# EasyEDA Pro project AcGunV2 - 副本.eprj

# Schematic Schematic1
Create Date: 2023-02-09; Page Name: P1; Project Name: AcGunV2 - 副本; Schematic Name: Schematic1; Update Date: 2023-03-13
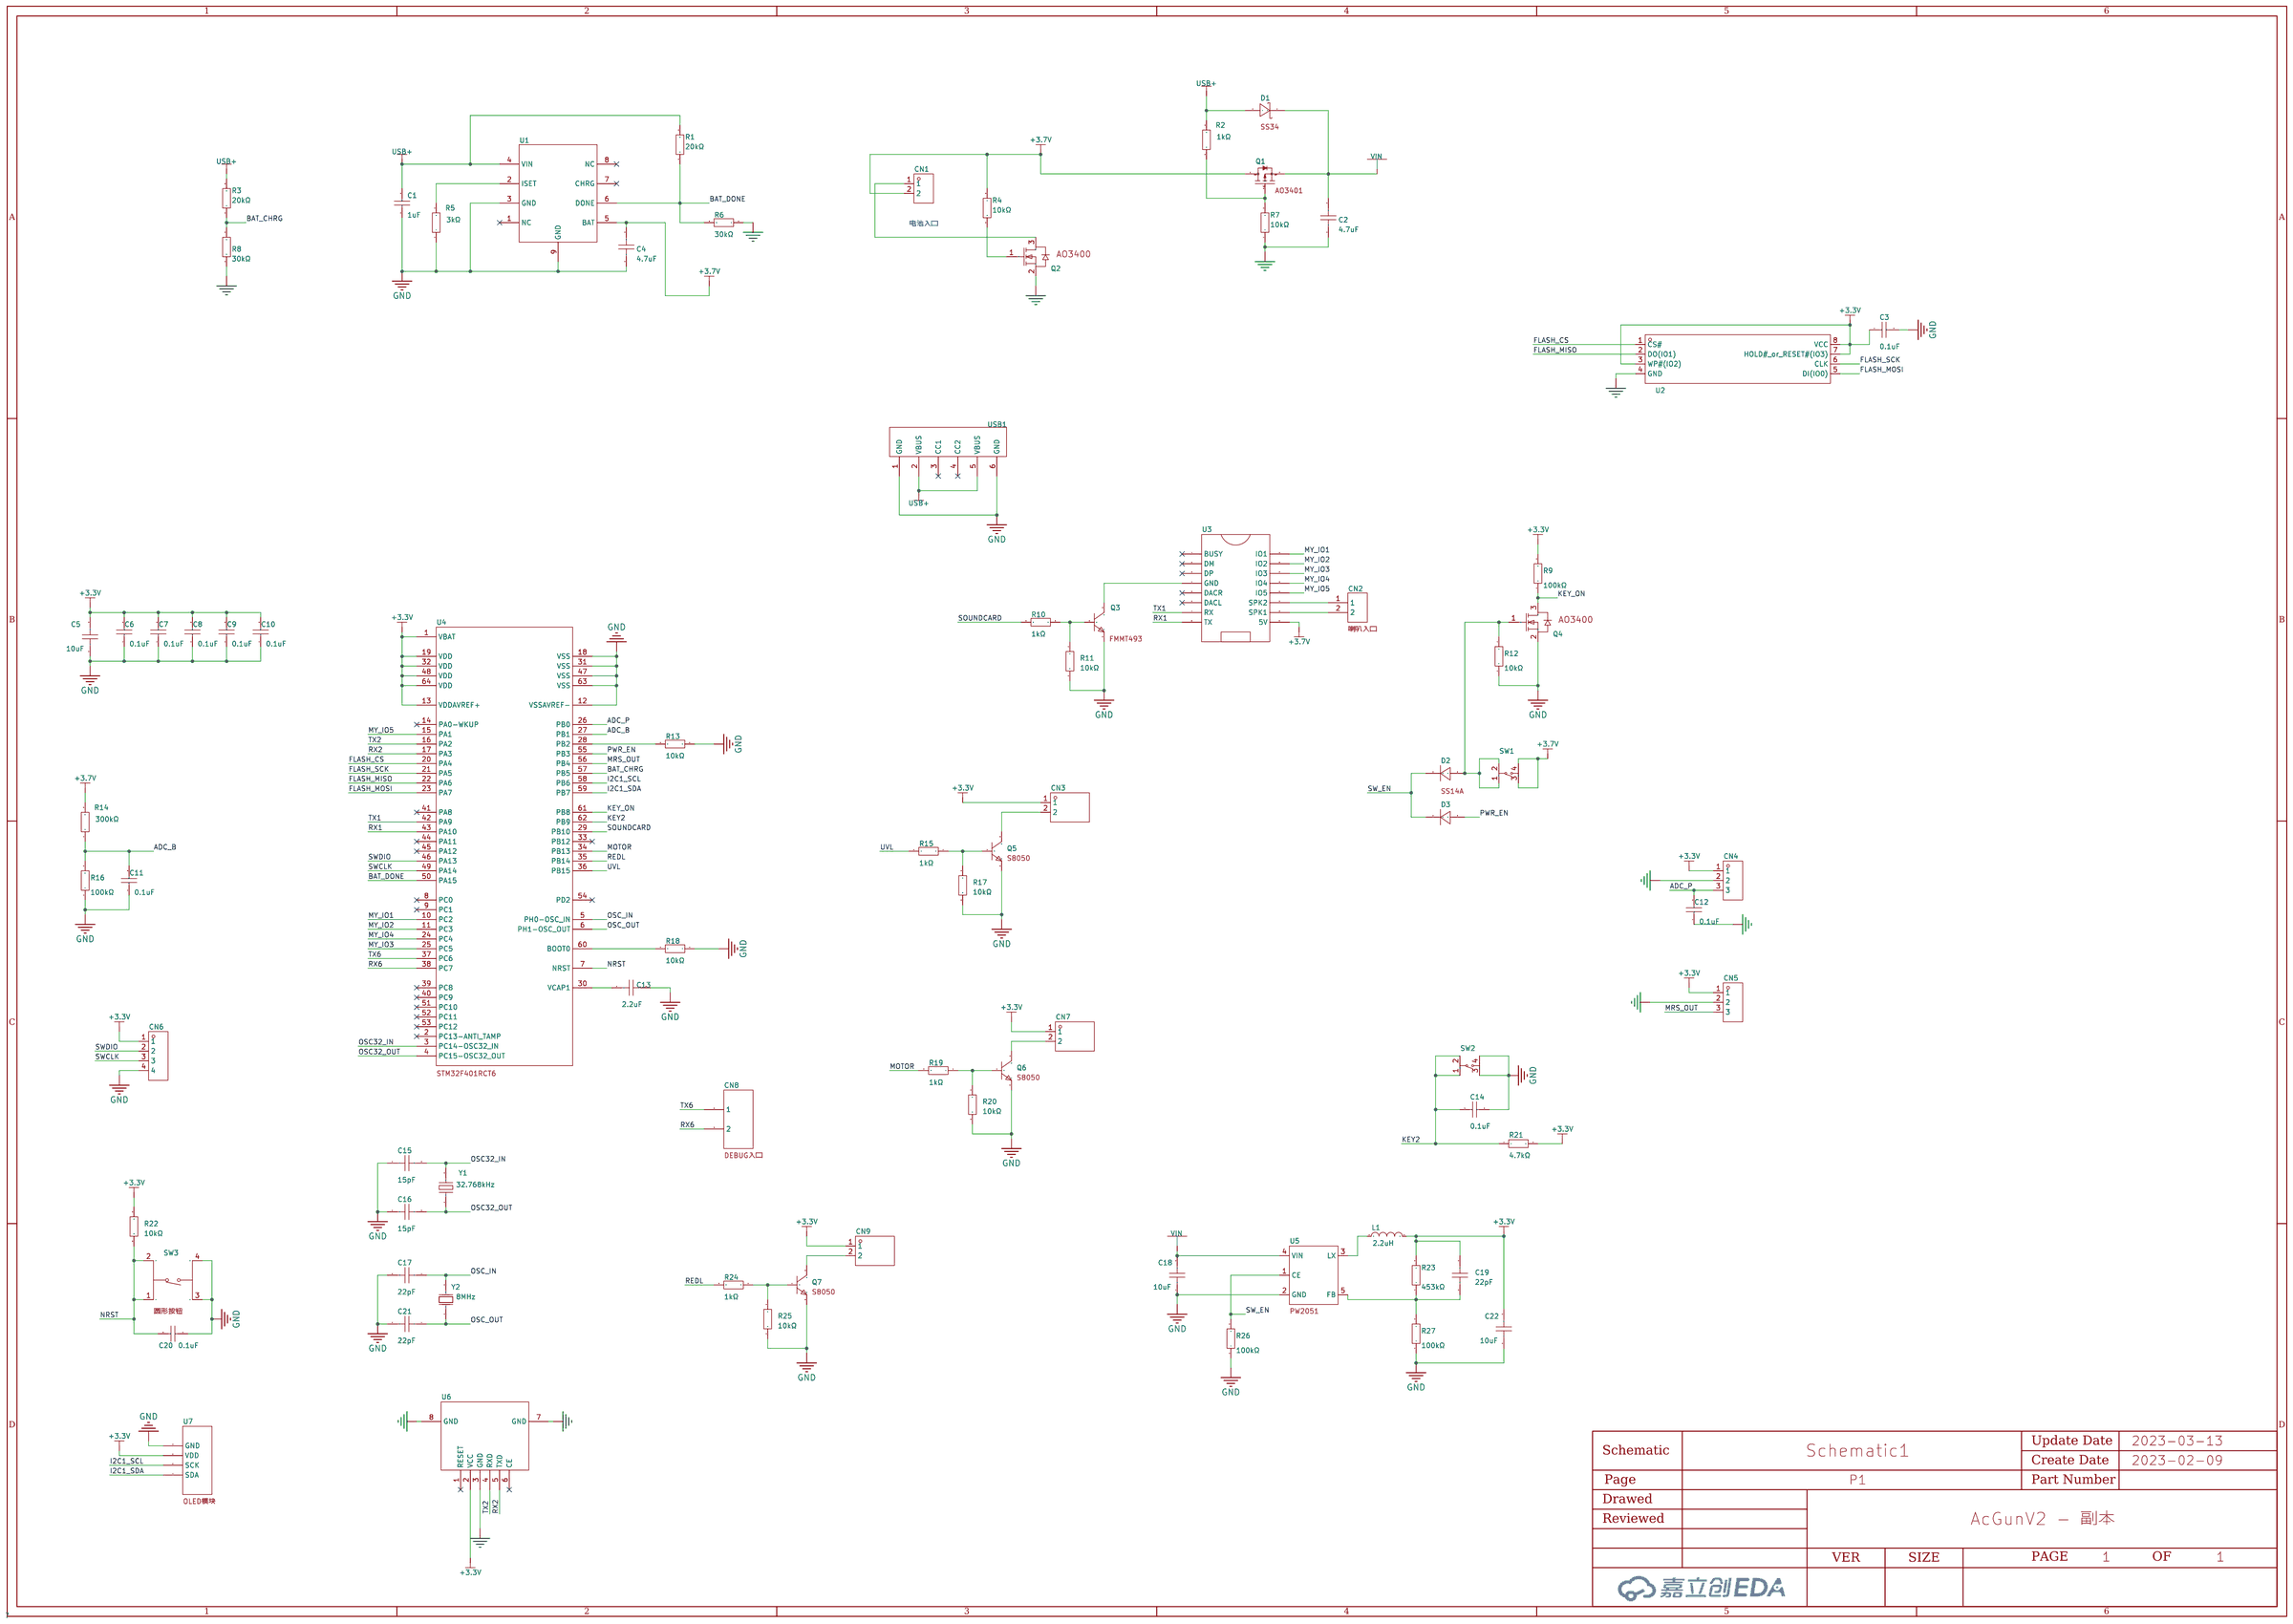
[diagram p0: schematic sheet]

## Parts
C1  1uF  [C0603]
C2  4.7uF  [C0603]
C3  0.1uF  [C0603]
C4  4.7uF  [C0603]
C5  10uF  [C0603]
C6  0.1uF  [C0603]
C7  0.1uF  [C0603]
C8  0.1uF  [C0603]
C9  0.1uF  [C0603]
C10  0.1uF  [C0603]
C11  0.1uF  [C0603]
C12  0.1uF  [C0603]  (no BOM)
C13  2.2uF  [C0603]
C14  0.1uF  [C0603]
C15  15pF  [C0603]
C16  15pF  [C0603]
C17  22pF  [C0603]
C18  10uF  [C0603]
C19  22pF  [C0603]
C20  0.1uF  [C0603]
C21  22pF  [C0603]
C22  10uF  [C0603]
CN1  HDGC2501WR-2P  [CONN-TH_2P-P2.50_HDGC2501WR-2P]
CN2  -  [2P接线点]  (no BOM)
CN3  -  [CONN-TH_2P-P1.25_1.25T-2AW]
CN4  HDGC1251WR-3P  [CONN-TH_3P-P1.25_HDGC_HDGC1251WR-3P]
CN5  HDGC1251WR-3P  [CONN-TH_3P-P1.25_HDGC_HDGC1251WR-3P]
CN6  1125-1104G0R138C002  [HDR-TH_4P-P2.54-H-M-W9.4]
CN7  -  [CONN-TH_2P-P1.25_1.25T-2AW]
CN8  -  [XH2.54插件2P]  (no BOM)
CN9  -  [CONN-TH_2P-P1.25_1.25T-2AW]
D1  -  [DO-214AC_L4.3-W2.7-LS5.3-RD]
D2  SS14A  [SMA_L4.3-W2.6-LS5.2-RD]
D3  SS14A  [SMA_L4.3-W2.6-LS5.2-RD]
L1  2.2uH  [IND-SMD_L4.0-W4.0_0.47UH04209.5A]
Q1  -  [SOT-23-3_L2.9-W1.3-P1.90-LS2.4-BR]
Q2  AO3400  [SOT-23_L2.9-W1.3-P1.90-LS2.4-BR]
Q3  FMMT493  [SOT-23-3_L3.0-W1.7-P0.95-LS2.9-BR]
Q4  AO3400  [SOT-23_L2.9-W1.3-P1.90-LS2.4-BR]
Q5  S8050  [SOT-23_L2.9-W1.3-P1.90-LS2.4-BR]
Q6  S8050  [SOT-23_L2.9-W1.3-P1.90-LS2.4-BR]
Q7  S8050  [SOT-23_L2.9-W1.3-P1.90-LS2.4-BR]
R1  20kΩ  [R0603]
R2  1kΩ  [R0603]
R3  20kΩ  [R0603]
R4  10kΩ  [R0603]
R5  3kΩ  [R0603]
R6  30kΩ  [R0603]
R7  10kΩ  [R0603]
R8  30kΩ  [R0603]
R9  100kΩ  [R0603]
R10  1kΩ  [R0603]
R11  10kΩ  [R0603]
R12  10kΩ  [R0603]
R13  10kΩ  [R0603]
R14  300kΩ  [R0603]
R15  1kΩ  [R0603]
R16  100kΩ  [R0603]
R17  10kΩ  [R0603]
R18  10kΩ  [R0603]
R19  1kΩ  [R0603]
R20  10kΩ  [R0603]
R21  4.7kΩ  [R0603]
R22  10kΩ  [R0603]
R23  453kΩ  [R0603]
R24  1kΩ  [R0603]
R25  10kΩ  [R0603]
R26  100kΩ  [R0603]
R27  100kΩ  [R0603]
SW1  -  [按钮开关]
SW2  -  [按钮开关]
SW3  1TS001G-2700-1500-CT  [SW-SMD_4P-L5.1-W5.1-P3.70-LS6.5-TL-2]
U1  -  [PW4056]
U2  W25Q32JVSSIQ  [SOIC-8_L5.3-W5.3-P1.27-LS8.0-BL]
U3  -  [MY2480]
U4  STM32F401RCT6  [LQFP-64_L10.0-W10.0-P0.50-LS12.0-BL]
U5  -  [PW2051]
U6  -  [GC2400-TC010R]
U7  -  [OLED模块封装]
USB1  -  [typec]
Y1  32.768kHz  [OSC-SMD_L3.2-W1.5]
Y2  8MHz  [OSC-SMD_L5.0-W3.2]

## Library data of the parts
C1 = 0603F105M250NT: 容值:1uF;精度:±20%;额定电压:25V;温度系数:Y5V;; LCSC Part Name: 1uF ±20% 25V; Supplier Part: C36577; Manufacturer: FH(风华); Supplier Footprint: 0603; JLCPCB Part Class: Extended Part; Datasheet: https://atta.szlcsc.com/upload/public/pdf/source/20170923/C36577_1506149443286988738.pdf; Supplier: LCSC; Tolerance: ±20%; Voltage Rated: 25V; Temperature Coefficient: Y5V
C2 C4 = 0603X475M160NT: 容值:4.7uF;精度:±20%;额定电压:16V;温度系数:X5R;; LCSC Part Name: 4.7uF ±20% 16V; Supplier Part: C417282; Manufacturer: FH(风华); Supplier Footprint: 0603; JLCPCB Part Class: Extended Part; Datasheet: https://atta.szlcsc.com/upload/public/pdf/source/20190828/C417282_9FA89336CC150C49D68906F9E844F6E8.pdf; Supplier: LCSC; Tolerance: ±20%; Voltage Rated: 16V; Temperature Coefficient: X5R
C3 C6-C12 C14 C20 = 0603B104K101CT: 容值:100nF;精度:±10%;额定电压:100V;温度系数:X7R;; LCSC Part Name: 100nF ±10% 100V; Supplier Part: C116838; Manufacturer: 华新科(Walsin); Supplier Footprint: 0603; JLCPCB Part Class: Extended Part; Datasheet: https://atta.szlcsc.com/upload/public/pdf/source/20190709/C116838_F1A9F4B47B8E555AD45D8607B90A094B.pdf; Supplier: LCSC; Tolerance: ±10%; Voltage Rated: 100V; Temperature Coefficient: X7R
C5 C18 C22 = 0603X106M100CT: 容值:10uF;精度:±20%;额定电压:10V;温度系数:X5R;; LCSC Part Name: 10uF ±20% 10V; Supplier Part: C89283; Manufacturer: 华新科(Walsin); Supplier Footprint: 0603; JLCPCB Part Class: Extended Part; Datasheet: https://atta.szlcsc.com/upload/public/pdf/source/20161226/1482720147964.pdf; Supplier: LCSC; Tolerance: ±20%; Voltage Rated: 10V; Temperature Coefficient: X5R
C13 = 0603B225K160CT: 容值:2.2uF;精度:±10%;额定电压:16V;温度系数:X7R;; LCSC Part Name: 2.2uF ±10% 16V; Supplier Part: C525501; Manufacturer: 华新科(Walsin); Supplier Footprint: 0603; JLCPCB Part Class: Extended Part; Datasheet: https://atta.szlcsc.com/upload/public/pdf/source/20191217/C469650_84AD5C6F618CF4AC0C6D987F2E8FE6F8.pdf; Supplier: LCSC; Tolerance: ±10%; Voltage Rated: 16V; Temperature Coefficient: X7R
C15 C16 = 0603CG150J500NT: 容值:15pF;精度:±5%;额定电压:50V;温度系数:C0G;; LCSC Part Name: 15pF ±5% 50V; Supplier Part: C91703; Manufacturer: FH(风华); Supplier Footprint: 0603; JLCPCB Part Class: Extended Part; Datasheet: https://atta.szlcsc.com/upload/public/pdf/source/20170105/1483610779016.pdf; Supplier: LCSC; Tolerance: ±5%; Voltage Rated: 50V; Temperature Coefficient: C0G
C17 C19 C21 = 0603CG220F500NT: 容值:22pF;精度:±1%;额定电压:50V;温度系数:C0G;; LCSC Part Name: 22pF ±1% 50V; Supplier Part: C190086; Manufacturer: FH(风华); Supplier Footprint: 0603; JLCPCB Part Class: Extended Part; Datasheet: https://atta.szlcsc.com/upload/public/pdf/source/20180403/C190086_AE2857A36C77ED36CE0DF753AD1C79C3.pdf; Supplier: LCSC; Tolerance: ±1%; Voltage Rated: 50V; Temperature Coefficient: C0G
CN1 = HDGC2501WR-2P: LCSC Part Name: XH2.5弯针 2P; Supplier Part: C5175255; Manufacturer: HDGC(华德共创); Supplier Footprint: 弯插,P=2.5mm; JLCPCB Part Class: Extended Part; Datasheet: https://atta.szlcsc.com/upload/public/pdf/source/20220916/C1717F8E2C78083BF9D63A459D48AEE1.pdf; Supplier: LCSC
CN2 = 2P接线点: 喇叭入口
CN3 CN7 CN9 = 1.25T-2AW米色: 参考系列:-;间距:1.25mm;插针结构:1x2P;排数:1;每排PIN数:2;行距:-;安装方式:-;触头材质:-;; LCSC Part Name: 1.25T弯针 1*2P 耐温; Supplier Part: C145979; Manufacturer: BOOMELE(博穆精密); Supplier Footprint: 插件,P=1.25mm; JLCPCB Part Class: Extended Part; Datasheet: https://atta.szlcsc.com/upload/public/pdf/source/20190411/C145979_53F66C0EC1FA80FB314D20799C316382.pdf; Supplier: LCSC; Pitch: 1.25mm; Pins Structure: 1x2P; Number of Rows: 1; Number of PINs Per Row: 2
CN4 CN5 = HDGC1251WR-3P: LCSC Part Name: MX1.25弯针 3P; Supplier Part: C5175204; Manufacturer: HDGC(华德共创); Supplier Footprint: 直插,P=1.25mm; JLCPCB Part Class: Extended Part; Datasheet: https://atta.szlcsc.com/upload/public/pdf/source/20220916/6B39EFECC0008CEF03BA0E93409F6DCC.pdf; Supplier: LCSC
CN6 = 1125-1104G0R138C002: 排数:单排;总PIN位数:4;间距:2.54mm;插针结构:1x4P;行距:2.54mm;安装类型:弯插;圆针/方针:方针;额定电流:3A;额定电压:320V;配合针长度:6mm;塑高:2.5mm;端接针长度:-;触头材质:黄铜;触头镀层:金;工作温度范围:-40~+105;颜色:黑色;; LCSC Part Name: 2.54mm 1x4P 弯插 方针; Supplier Part: C721443; Manufacturer: Wcon(维峰电子); Supplier Footprint: 弯插,P=2.54mm; JLCPCB Part Class: Extended Part; Datasheet: https://atta.szlcsc.com/upload/public/pdf/source/20200817/C721441_9C294CE567E7CA2BF1A06D224BABC3D8.pdf; Supplier: LCSC; Number of Rows: 单排; Number of Pins: 4; Pitch: 2.54mm; Pin Structure: 1x4P; Row Spacing: 2.54mm; Mounting Type: 弯插; Circluar Pins/Square Pins: 方针; Current Rating (Max): 3A; Voltage Rating (Max): 320V; Length of Mating Pin: 6mm; Insulation Height: 2.5mm; Contact Material: 黄铜; Contact Plating: 金; Operating Temperature Range: -40~+105; Color: 黑色
CN8 = XH2.54插件2P: DEBUG入口
D1 = SS34_C8678: 直流反向耐压(Vr):40V;平均整流电流(Io):3A;正向压降(Vf):550mV@3A;; LCSC Part Name: 40V 3A 550mV@3A; Supplier Part: C8678; Manufacturer: MDD; Manufacturer Part: SS34; Supplier Footprint: SMA(DO-214AC); JLCPCB Part Class: Basic Part; Datasheet: https://atta.szlcsc.com/upload/public/pdf/source/20210506/C15874_5BDBC70F665BA444FCE0210303DB2A89.pdf; Supplier: LCSC; Reverse Voltage (Vr): 40V; Average Rectified Current (Io): 3A; Forward Voltage (Vf@If): 550mV@3A
D2 D3 = SS14A: 直流反向耐压(Vr):40V;平均整流电流(Io):1A;正向压降(Vf):500mV@1A;; LCSC Part Name: 40V 1A 500mV@1A; Supplier Part: C211770; Manufacturer: YANGJIE(扬杰); Supplier Footprint: SMA(DO-214AC); JLCPCB Part Class: Extended Part; Datasheet: https://atta.szlcsc.com/upload/public/pdf/source/20180504/C211770_627C435F34E9C107E4A4301F69D28675.pdf; Supplier: LCSC; Reverse Voltage (Vr): 40V; Average Rectified Current (Io): 1A; Forward Voltage (Vf@If): 500mV@1A
L1 = 2.2uh3a电感: 电感值:2.2uH;精度:±20%;额定电流:3A;直流电阻(DCR):-;; Rated Current: 3A; Supplier: LCSC; Supplier Part: C438930; Supplier Footprint: SMD; LCSC Part Name: 2.2uH ±20% 3A; Tolerance: ±20%; Manufacturer: Cybermax(思博科技); Manufacturer Part: CMLO0420H2R2MTT
Q1 = AO3401_C181091: 类型:P沟道;漏源电压(Vdss):30V;连续漏极电流(Id):4.2A;功率(Pd):350mW;导通电阻(RDS(on)@Vgs,Id):65mΩ@10V,4.2A;阈值电压(Vgs(th)@Id):1.3V@250A;; LCSC Part Name: P沟道 30V 4.2A; Supplier Part: C181091; Manufacturer: Hottech(合科泰); Manufacturer Part: AO3401; Supplier Footprint: SOT-23(SOT-23-3); JLCPCB Part Class: Extended Part; Datasheet: https://atta.szlcsc.com/upload/public/pdf/source/20180131/C181091_15173931948391329220.pdf; Supplier: LCSC; Type: P沟道; Drain Source Voltage (Vdss): 30V; Continuous Drain Current (Id): 4.2A; Power Dissipation (Pd): 350mW; Drain Source On Resistance (RDS(on)@Vgs,Id): 65mΩ@10V,4.2A; Gate Threshold Voltage (Vgs(th)@Id): 1.3V@250A
Q2 Q4 = AO3400: 类型:N沟道;漏源电压(Vdss):30V;连续漏极电流(Id):5.8A;功率(Pd):1.5W;导通电阻(RDS(on)@Vgs,Id):35mΩ@10V,5.8A;阈值电压(Vgs(th)@Id):1.2V@250uA;栅极电荷(Qg@Vgs):-;输入电容(Ciss@Vds):1050pF@15V;反向传输电容(Crss@Vds):77pF@15V;工作温度:+150@(Tj);; LCSC Part Name: N沟道 30V 5.8A; Supplier Part: C2938367; Manufacturer: GOODWORK(固得沃克); Supplier Footprint: SOT23; JLCPCB Part Class: Extended Part; Datasheet: https://atta.szlcsc.com/upload/public/pdf/source/20211229/1DE691E24B5B31BB262C463D0489A9AB.pdf; Supplier: LCSC; Type: N沟道; Drain Source Voltage (Vdss): 30V; Continuous Drain Current (Id): 5.8A; Power Dissipation (Pd): 1.5W; Drain Source On Resistance (RDS(on)@Vgs,Id): 35mΩ@10V,5.8A; Gate Threshold Voltage (Vgs(th)@Id): 1.2V@250uA; Input Capacitance (Ciss@Vds): 1050pF@15V; Reverse Transfer Capacitance (Crss@Vds): 77pF@15V; Operating Temperature: +150@(Tj)
Q3 = FMMT493_C77886: 晶体管类型:NPN;集射极击穿电压(Vceo):100V;集电极电流(Ic):1A;功率(Pd):250mW;; LCSC Part Name: NPN 100V 1A; Supplier Part: C77886; Manufacturer: CJ(江苏长电/长晶); Supplier Footprint: SOT-23; JLCPCB Part Class: Extended Part; Datasheet: https://atta.szlcsc.com/upload/public/pdf/source/20160713/1468379863380.pdf; Supplier: LCSC; Transistor Type: NPN; Collector-Emitter Breakdown Voltage (Vceo): 100V; Collector Current (Ic): 1A; Power Dissipation (Pd): 250mW
Q5-Q7 = S8050: 晶体管类型:NPN;集射极击穿电压(Vceo):25V;集电极电流(Ic):500mA;功率(Pd):625mW;集电极-发射极饱和电压(VCE(sat)@Ic,Ib):600mV@500mA,50mA;直流电流增益(hFE@Ic,Vce):200@100mA,1V;特征频率(fT):150MHz;工作温度:+150@(Tj);; LCSC Part Name: NPN 25V 500mA; Supplier Part: C414195; Manufacturer: GP(格瑞宝); Supplier Footprint: SOT-23; JLCPCB Part Class: Extended Part; Datasheet: https://atta.szlcsc.com/upload/public/pdf/source/20190828/C414195_F420B1E456405127F3181AB0586AEC6F.pdf; Supplier: LCSC; Transistor Type: NPN; Collector-Emitter Breakdown Voltage (Vceo): 25V; Collector Current (Ic): 500mA; Power Dissipation (Pd): 625mW; Collector-Emitter Saturation Voltage (VCE(sat)@Ic,Ib): 600mV@500mA,50mA; DC Current Gain (hFE@Ic,Vce): 200@100mA,1V; Transition Frequency (fT): 150MHz; Operating Temperature: +150@(Tj)
R1 R3 = RC0603DR-0720KL: 电阻类型:厚膜电阻;阻值:20kΩ;精度:±0.5%;功率:100mW;温度系数:±100ppm/;最大工作电压:75V;工作温度范围:-55~+155;; LCSC Part Name: 20kΩ ±0.5%; Supplier Part: C137817; Manufacturer: YAGEO(国巨); Supplier Footprint: 0603; JLCPCB Part Class: Extended Part; Datasheet: https://atta.szlcsc.com/upload/public/pdf/source/20171106/C137817_15099606819651093946.pdf; Supplier: LCSC; Type: 厚膜电阻; Tolerance: ±0.5%; Power(Watts): 100mW; Temperature Coefficient: ±100ppm/; Overload Voltage (Max): 75V; Operating Temperature Range: -55~+155
R2 R10 R15 R19 R24 = TR0603B1K00P0525Z: 电阻类型:薄膜电阻;阻值:1kΩ;精度:±0.1%;功率:100mW;温度系数:±25ppm/;最大工作电压:75V;工作温度范围:-55~+155;; LCSC Part Name: 1kΩ ±0.1%; Supplier Part: C188364; Manufacturer: EVER OHMS(天二科技); Supplier Footprint: 0603; JLCPCB Part Class: Extended Part; Datasheet: https://atta.szlcsc.com/upload/public/pdf/source/20190415/C188364_2560310032FA915A7069B8237DA8774F.pdf; Supplier: LCSC; Type: 薄膜电阻; Tolerance: ±0.1%; Power(Watts): 100mW; Temperature Coefficient: ±25ppm/; Overload Voltage (Max): 75V; Operating Temperature Range: -55~+155
R4 R7 R11-R13 R17 R18 R20 R22 R25 = SY0603JN10KP: 阻值:10kΩ;精度:±5%;功率:1/16W;温度系数:±100ppm/;; LCSC Part Name: 10kΩ ±5%; Supplier Part: C380762; Manufacturer: SANYEAR(叁叶源); Supplier Footprint: 0603; JLCPCB Part Class: Extended Part; Datasheet: https://atta.szlcsc.com/upload/public/pdf/source/20190402/C380762_D09B63EB8DF4AE0F44268631C04132BC.pdf; Supplier: LCSC; Tolerance: ±5%; Power(Watts): 1/16W; Temperature Coefficient: ±100ppm/
R5 = 0603WAJ0302T5E: 电阻类型:厚膜电阻;阻值:3kΩ;精度:±5%;功率:1/10W;温度系数:±100ppm/;最大工作电压:75V;工作温度范围:-55~+155;; LCSC Part Name: 3kΩ ±5%; Supplier Part: C25597; Manufacturer: UNI-ROYAL(厚声); Supplier Footprint: 0603; JLCPCB Part Class: Extended Part; Datasheet: https://atta.szlcsc.com/upload/public/pdf/source/20200306/C422600_1E6D84923E4A46A82E41ADD87F860B5C.pdf; Supplier: LCSC; Type: 厚膜电阻; Tolerance: ±5%; Power(Watts): 1/10W; Temperature Coefficient: ±100ppm/; Overload Voltage (Max): 75V; Operating Temperature Range: -55~+155
R6 R8 = AC0603FR-0730KL: 电阻类型:厚膜电阻;阻值:30kΩ;精度:±1%;功率:100mW;温度系数:±100ppm/;最大工作电压:75V;工作温度范围:-55~+155;; LCSC Part Name: 30kΩ ±1%; Supplier Part: C144670; Manufacturer: YAGEO(国巨); Supplier Footprint: 0603; JLCPCB Part Class: Extended Part; Datasheet: https://atta.szlcsc.com/upload/public/pdf/source/20171225/C144670_15141880418861202957.pdf; Supplier: LCSC; Type: 厚膜电阻; Tolerance: ±1%; Power(Watts): 100mW; Temperature Coefficient: ±100ppm/; Overload Voltage (Max): 75V; Operating Temperature Range: -55~+155
R9 R16 R26 R27 = MCT06030C1003FP500: 电阻类型:薄膜电阻;阻值:100kΩ;精度:±1%;功率:100mW;温度系数:±50ppm/K;最大工作电压:75V;工作温度范围:-55~+125;; LCSC Part Name: 100kΩ ±1%; Supplier Part: C161805; Manufacturer: VISHAY(威世); Supplier Footprint: 0603; JLCPCB Part Class: Extended Part; Datasheet: https://atta.szlcsc.com/upload/public/pdf/source/20180125/C161805_15168649470331302834.pdf; Supplier: LCSC; Type: 薄膜电阻; Tolerance: ±1%; Power(Watts): 100mW; Temperature Coefficient: ±50ppm/K; Overload Voltage (Max): 75V; Operating Temperature Range: -55~+125
R14 = RC0603FR-07300KL: 阻值:300kΩ;精度:±1%;功率:100mW;温度系数:±100ppm/;最大工作电压:75V;工作温度范围:-55~+155;; LCSC Part Name: 300kΩ ±1%; Supplier Part: C114667; Manufacturer: YAGEO(国巨); Supplier Footprint: 0603; JLCPCB Part Class: Extended Part; Datasheet: https://atta.szlcsc.com/upload/public/pdf/source/20170818/C114667_1503051153004895128.pdf; Supplier: LCSC; Tolerance: ±1%; Power(Watts): 100mW; Temperature Coefficient: ±100ppm/; Overload Voltage (Max): 75V; Operating Temperature Range: -55~+155
R21 = RMC 0603 4K7 F N: 阻值:4.7kΩ;精度:±1%;功率:0.1W;; LCSC Part Name: 4.7kΩ ±1%; Supplier Part: C269713; Manufacturer: Tyohm(幸亚电阻); Supplier Footprint: 0603; JLCPCB Part Class: Extended Part; Datasheet: https://atta.szlcsc.com/upload/public/pdf/source/20190115/C269713_06B12CBF45628C37C65359B185ED7F9D.pdf; Supplier: LCSC; Tolerance: ±1%; Power(Watts): 0.1W
R23 = 0603WAF4533T5E: 电阻类型:厚膜电阻;阻值:453kΩ;精度:±1%;功率:1/10W;温度系数:±100ppm/;最大工作电压:75V;工作温度范围:-55~+155;; LCSC Part Name: 453kΩ ±1%; Supplier Part: C25818; Manufacturer: UNI-ROYAL(厚声); Supplier Footprint: 0603; JLCPCB Part Class: Extended Part; Datasheet: https://atta.szlcsc.com/upload/public/pdf/source/20200306/C422600_1E6D84923E4A46A82E41ADD87F860B5C.pdf; Supplier: LCSC; Type: 厚膜电阻; Tolerance: ±1%; Power(Watts): 1/10W; Temperature Coefficient: ±100ppm/; Overload Voltage (Max): 75V; Operating Temperature Range: -55~+155
SW1 SW2 = 按键开关
SW3 = 1TS001G-2700-1500-CT: 触点电流:20mA;额定电压(DC):12V;电路结构:单刀单掷;安装方式:立贴;按钮形状:圆形按钮;带灯:-;开关长度:5.1mm;开关宽度:5.1mm;开关高度:0.3mm;; LCSC Part Name: 铜头按钮; Supplier Part: C318800; Manufacturer: HYP(鸿源精密); Supplier Footprint: SMD,5.1x5.1mm; JLCPCB Part Class: Extended Part; Datasheet: https://atta.szlcsc.com/upload/public/pdf/source/20200109/C318800_E3EE45BECD3EEEC6701309AC007B685B.pdf; Supplier: LCSC; Contact Current: 20mA; Voltage Rating (DC): 12V; Circuit: 单刀单掷; Mounting Style: 立贴; Actuator Style: 圆形按钮; Switch Length: 5.1mm; Switch Width: 5.1mm; Switch Height: 0.3mm
U1 = PW4056: 带OVP充电芯片
U2 = W25Q32JVSSIQ: Supplier Part: C179173; Manufacturer: WINBOND(华邦); Supplier Footprint: SOIC-8; JLCPCB Part Class: Extended Part; Datasheet: https://atta.szlcsc.com/upload/public/pdf/source/20191218/C179173_5BBD793D2D7B3672E140BC7AE85C11FF.pdf; Supplier: LCSC
U3 = MY2480: MY2480发声模块
U4 = STM32F401RCT6: 主频（MAX):84MHz;工作电压:1.7V ~ 3.6V;; Supplier Part: C74524; Manufacturer: ST(意法半导体); Supplier Footprint: LQFP-64_10x10x05P; JLCPCB Part Class: Extended Part; Datasheet: https://atta.szlcsc.com/upload/public/pdf/source/20170728/C74524_1501225886278849063.pdf; Supplier: LCSC; Speed: 84MHz; Voltage - Supply (Vcc/Vdd): 1.7V ~ 3.6V; Program Memory Size: 256KB; RAM Size: 64KB; Number of I/O: 50; A/D: 16x12bit; PWM: 32; UART/USART: 3 USART; SPI: 3; I2C（SMBUS/PMBUS）: 2; USB Device: 1; USB Host/OTG: 1
U5 = PW2051: Supplier: LCSC; Supplier Part: C9900004763; Supplier Footprint: SOT23-5; JLCPCB Part Class: Extended Part; Datasheet: 2021-12-24/856123Z/fbe1facec1e64a42b88c21fe7c936e8d/PW2051.pdf
U6 = GC2400-TC010R: 无线模块
U7 = 长型OLED屏幕: OLED模块
USB1 = typec
Y1 = FC-135 32.7680KA-A: 晶振类型:贴片无源晶振;频率:32.768kHz;频率公差:±20ppm;频率稳定度:-;负载电容:12.5pF;等效串联电阻(ESR):70kΩ;工作温度:-40~+85;; LCSC Part Name: 32.768kHz ±20ppm 12.5pF; Supplier Part: C1669857; Manufacturer: EPSON(爱普生); Supplier Footprint: SMD3215-2P; JLCPCB Part Class: Extended Part; Datasheet: https://atta.szlcsc.com/upload/public/pdf/source/20211127/C1669857_BFFF152418C2E970D8F3A70555C7D233.pdf; Supplier: LCSC; Crystal Type: 贴片无源晶振; Frequency Tolerance: ±20ppm; Load Capacitance: 12.5pF; Equivalent Series Resistance (ESR): 70kΩ; Operating Temperature: -40~+85
Y2 = 7A08000001: 晶振类型:贴片无源晶振;频率:8MHz;频率公差:±20ppm;负载电容:20pF;等效串联电阻(ESR):80Ω;工作温度:-10~+70;; LCSC Part Name: 8MHz ±20ppm 20pF; Supplier Part: C90881; Manufacturer: TXC(晶技); Supplier Footprint: SMD5032-2P; JLCPCB Part Class: Extended Part; Datasheet: https://atta.szlcsc.com/upload/public/pdf/source/20161217/1481939178746.pdf; Supplier: LCSC; Crystal Type: 贴片无源晶振; Frequency Tolerance: ±20ppm; Load Capacitance: 20pF; Equivalent Series Resistance (ESR): 80Ω; Operating Temperature: -10~+70

## Nets
+3.3V: C3.1 C5.2 C6.2 C7.2 C8.2 C9.2 C10.2 C19.1 C22.2 CN3.1 CN4.1 CN5.1 CN6.1 CN7.1 CN9.1 L1.2 R9.2 R21.2 R22.1 R23.2 U2.3(WP#(IO2)) U2.7(HOLD# or RESET#(IO3)) U2.8(VCC) U4.1(VBAT) U4.13(VDDAVREF+) U4.19(VDD) U4.32(VDD) U4.48(VDD) U4.64(VDD) U6.2(VCC) U7.2(VDD)
+3.7V: C4.2 CN1.2 Q1.3(D) R4.2 R14.2 SW1.3(C) SW1.4(D) U1.5(BAT) U3.9(5V)
GND: C1.1 C2.1 C3.2 C4.1 C5.1 C6.1 C7.1 C8.1 C9.1 C10.1 C11.1 C12.1 C13.2 C14.1 C15.1 C16.1 C17.2 C18.1 C20.1 C21.2 C22.1 CN4.2 CN5.2 CN6.4 Q2.2(S) Q3.2(E) Q4.2(S) Q5.2(E) Q6.2(E) Q7.2(E) R5.1 R6.1 R7.1 R8.1 R11.2 R12.2 R13.1 R16.1 R17.2 R18.1 R20.2 R25.2 R26.1 R27.1 SW2.3(C) SW2.4(D) SW3.3(C) SW3.4(D) U1.3(GND) U1.9(GND) U2.4(GND) U4.12(VSSAVREF-) U4.18(VSS) U4.31(VSS) U4.47(VSS) U4.63(VSS) U5.2(GND) U6.3(GND) U6.7(GND) U6.8(GND) U7.1(GND) USB1.1(GND) USB1.6(GND)
VIN: C2.2 C18.2 D1.1(K) Q1.2(S) U5.4(VIN)
ADC_B: C11.2 R14.1 R16.2 U4.27(PB1)
ADC_P: C12.2 CN4.3 U4.26(PB0)
BAT_CHRG: R3.1 R8.2 U4.57(PB5)
BAT_DONE: R1.1 R6.2 U1.6(DONE) U4.50(PA15)
FLASH_CS: U2.1(CS#) U4.20(PA4)
FLASH_MISO: U2.2(DO(IO1)) U4.22(PA6)
FLASH_MOSI: U2.5(DI(IO0)) U4.23(PA7)
FLASH_SCK: U2.6(CLK) U4.21(PA5)
I2C1_SCL: U4.58(PB6) U7.3(SCK)
I2C1_SDA: U4.59(PB7) U7.4(SDA)
KEY2: C14.2 R21.1 SW2.1(A) SW2.2(B) U4.62(PB9)
KEY_ON: Q4.3(D) R9.1 U4.61(PB8)
MOTOR: R19.2 U4.34(PB13)
MRS_OUT: CN5.3 U4.56(PB4)
MY_IO1: U3.16(IO1) U4.10(PC2)
MY_IO2: U3.15(IO2) U4.11(PC3)
MY_IO3: U3.14(IO3) U4.25(PC5)
MY_IO4: U3.13(IO4) U4.24(PC4)
MY_IO5: U3.12(IO5) U4.15(PA1)
NRST: C20.2 R22.2 SW3.1(A) SW3.2(B) U4.7(NRST)
OSC32_IN: C15.2 U4.3(PC14-OSC32_IN) Y1.2
OSC32_OUT: C16.2 U4.4(PC15-OSC32_OUT) Y1.1
OSC_IN: C17.1 U4.5(PH0-OSC_IN) Y2.2(OSC2)
OSC_OUT: C21.1 U4.6(PH1-OSC_OUT) Y2.1(OSC1)
PWR_EN: D3.2(A) U4.55(PB3)
REDL: R24.2 U4.35(PB14)
RX1: U3.8(TX) U4.43(PA10)
RX2: U4.17(PA3) U6.5(TXD)
RX6: CN8.2 U4.38(PC7)
SOUNDCARD: R10.2 U4.29(PB10)
SW_EN: D2.1(C) D3.1(C) R26.2 U5.1(CE)
SWCLK: CN6.3 U4.49(PA14)
SWDIO: CN6.2 U4.46(PA13)
TX1: U3.7(RX) U4.42(PA9)
TX2: U4.16(PA2) U6.4(RXD)
TX6: CN8.1 U4.37(PC6)
USB+: C1.2 D1.2(A) R1.2 R2.2 R3.2 U1.4(VIN) USB1.2(VBUS) USB1.5(VBUS)
UVL: R15.2 U4.36(PB15)
$1N1304: C13.1 U4.30(VCAP1)
$1N1668: R18.2 U4.60(BOOT0)
$1N1829: R13.2 U4.28(PB2)
$1N9984: CN9.2 Q7.3(C)
$1N10713: Q7.1(B) R24.1 R25.1
$1N11694: CN7.2 Q6.3(C)
$1N11697: Q6.1(B) R19.1 R20.1
$1N15476: L1.1 U5.3(LX)
$1N15617: C19.2 R23.1 R27.2 U5.5(FB)
$1N23471: D2.2(A) Q4.1(G) R12.1 SW1.1(A) SW1.2(B)
$1N28745: Q3.1(B) R10.1 R11.1
$1N30076: Q3.3(C) U3.4(GND)
$1N30362: CN2.1 U3.11(SPK2)
$1N30425: CN2.2 U3.10(SPK1)
$1N40650: R5.2 U1.2(ISET)
$1N44119: CN1.1 Q2.3(D)
$1N77249: Q2.1(G) R4.1
$1N80171: Q1.1(G) R2.1 R7.2
$1N140145: Q5.1(B) R15.1 R17.1
$1N144140: CN3.2 Q5.3(C)

Not connected (* = marked no-connect by the designer): U1 1(NC)* 7(CHRG)* 8(NC)*; U3 1(BUSY)* 2(DM)* 3(DP)* 5(DACR)* 6(DACL)*; U4 2(PC13-ANTI_TAMP)* 8(PC0)* 9(PC1)* 14(PA0-WKUP)* 33(PB12)* 39(PC8)* 40(PC9)* 41(PA8)* 44(PA11)* 45(PA12)* 51(PC10)* 52(PC11)* 53(PC12)* 54(PD2)*; U6 1(RESET)* 6(CE)*; USB1 3(CC1)* 4(CC2)*

## Notes on the sheet
- 电池入口

# Board PCB1
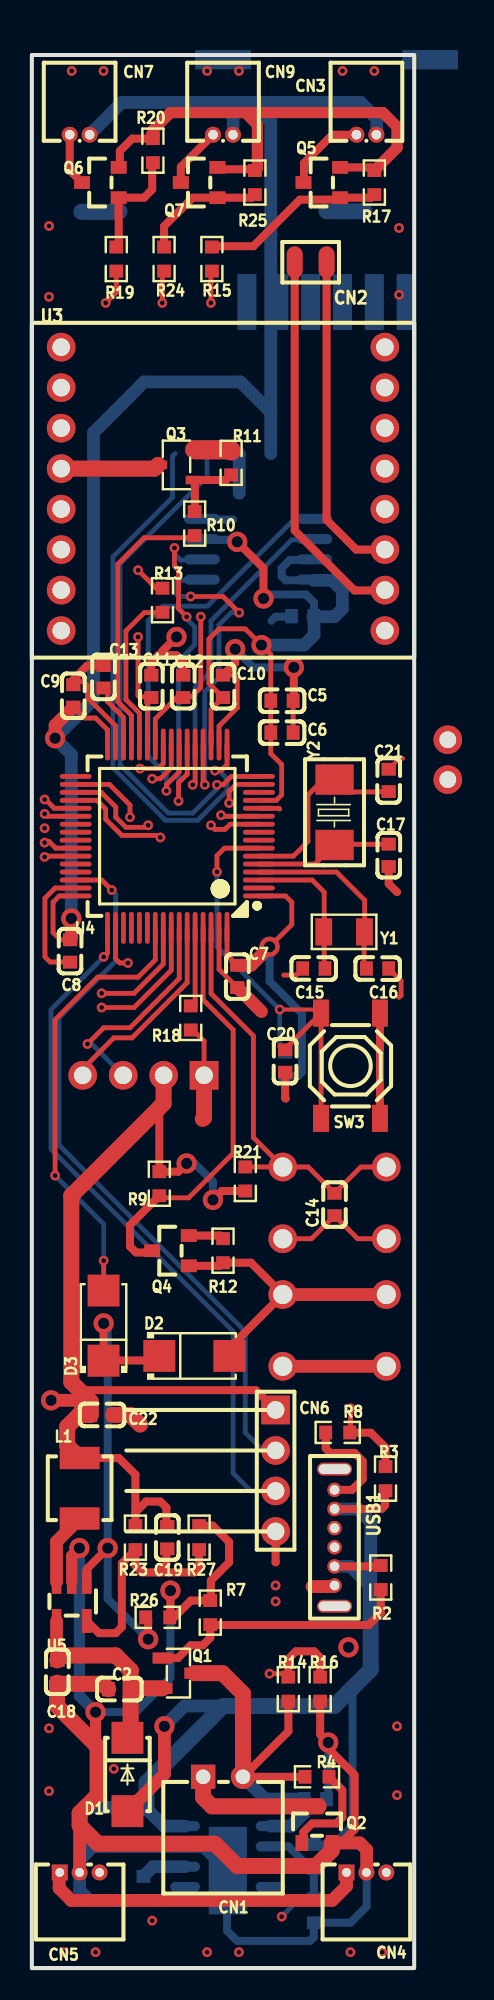
[diagram p1: board, top side]
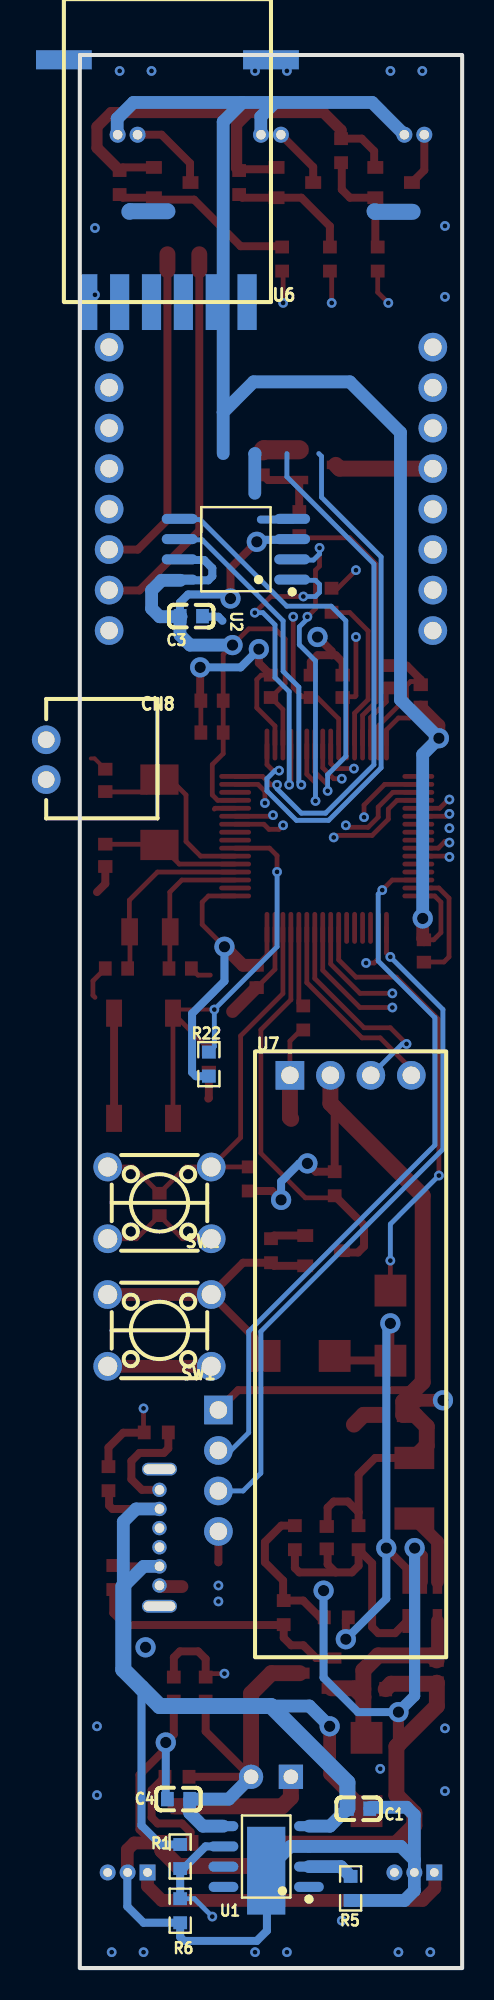
[diagram p2: board, bottom side, seen from below]

Outline 24 x 120 mm; copper layers: Top Layer, CPU1, CPU2, Bottom Layer. Coordinates in mm from the lower left corner of the outline.
Outline path: rectangle 0,120 24,0
Stack: Top Layer 0.035mm / Dielectric1 0.48mm PP er 4.5 / CPU1 0.035mm / Dielectric2 0.48mm FR4 er 4.5 / CPU2 0.035mm / Dielectric3 0.48mm PP er 4.5 / Bottom Layer 0.035mm

## Design rules (mm)
spacing safeClearance (default): track to track 0.152, other pairs 0.152 to 0.3
track width trackWidth (default): min 0.127, default 0.254, max 2.54
differential pair differentialPair (default): width min 0.127, default 0.254, max 2.54; gap min 0.152, default 0.152
via viaSize (default): diameter min 0.5, default 0.61, max 10; hole min 0.3, default 0.305, max 6

## Placement (name value [footprint] x y rotation side)
C1  1uF  [C0603]  6.5 10 0 bottom
C2  4.7uF  [C0603]  5.5 17.5 0 top
C3  0.1uF  [C0603]  17 84.8 180 bottom
C4  4.7uF  [C0603]  17.8 10.6 180 bottom
C5  10uF  [C0603]  15.7 79.5 180 top
C6  0.1uF  [C0603]  15.7 77.5 180 top
C7  0.1uF  [C0603]  12.9 62.2 90 top
C8  0.1uF  [C0603]  2.4 63.8 90 top
C9  0.1uF  [C0603]  2.6 79.8 270 top
C10  0.1uF  [C0603]  12 80.4 270 top
C11  0.1uF  [C0603]  7.5 80.4 270 top
C12  0.1uF  [C0603]  9.5 80.4 270 top
C13  2.2uF  [C0603]  4.5 81 90 top
C14  0.1uF  [C0603]  19 47.9 90 top
C15  15pF  [C0603]  17.7 62.7 0 top
C16  15pF  [C0603]  21.7 62.7 180 top
C17  22pF  [C0603]  22.4 69.8 270 top
C18  10uF  [C0603]  1.6 18.6 90 top
C19  22pF  [C0603]  8.5 27 270 top
C20  0.1uF  [C0603]  15.9 56.9 90 top
C21  22pF  [C0603]  22.4 74.5 90 top
C22  10uF  [C0603]  4.4 34.7 180 top
CN1  HDGC2501WR-2P  [CONN-TH_2P-P2.50_HDGC2501WR-2P]  12 12 0 top
CN2  -  [2P接线点]  17.5 107 180 top
CN3  -  [CONN-TH_2P-P1.25_1.25T-2AW]  21 115 180 top
CN4  HDGC1251WR-3P  [CONN-TH_3P-P1.25_HDGC_HDGC1251WR-3P]  21 6 0 top
CN5  HDGC1251WR-3P  [CONN-TH_3P-P1.25_HDGC_HDGC1251WR-3P]  3 6 0 top
CN6  1125-1104G0R138C002  [HDR-TH_4P-P2.54-H-M-W9.4]  15.3 31.2 270 top
CN7  -  [CONN-TH_2P-P1.25_1.25T-2AW]  3 115 180 top
CN8  -  [XH2.54插件2P]  22.3 75.8 90 bottom
CN9  -  [CONN-TH_2P-P1.25_1.25T-2AW]  12 115 180 top
D1  -  [DO-214AC_L4.3-W2.7-LS5.3-RD]  6 12.15 270 top
D2  SS14A  [SMA_L4.3-W2.6-LS5.2-RD]  10.2 38.4 0 top
D3  SS14A  [SMA_L4.3-W2.6-LS5.2-RD]  4.5 40.3 90 top
L1  2.2uH  [IND-SMD_L4.0-W4.0_0.47UH04209.5A]  3 30.1 90 top
Q1  -  [SOT-23-3_L2.9-W1.3-P1.90-LS2.4-BR]  9.2 18.5 180 top
Q2  AO3400  [SOT-23_L2.9-W1.3-P1.90-LS2.4-BR]  17.9 9 270 top
Q3  FMMT493  [SOT-23-3_L3.0-W1.7-P0.95-LS2.9-BR]  9.08 94.29 0 top
Q4  AO3400  [SOT-23_L2.9-W1.3-P1.90-LS2.4-BR]  8.7 45 0 top
Q5  S8050  [SOT-23_L2.9-W1.3-P1.90-LS2.4-BR]  18.2 112 0 top
Q6  S8050  [SOT-23_L2.9-W1.3-P1.90-LS2.4-BR]  4.3 112 0 top
Q7  S8050  [SOT-23_L2.9-W1.3-P1.90-LS2.4-BR]  10.5 112 0 top
R1  20kΩ  [R0603]  17.7 7 90 bottom
R2  1kΩ  [R0603]  21.9 24.5 90 top
R3  20kΩ  [R0603]  22.2 30.7 270 top
R4  10kΩ  [R0603]  17.9 12 180 top
R5  3kΩ  [R0603]  7 5 90 bottom
R6  30kΩ  [R0603]  17.7 3.6 90 bottom
R7  10kΩ  [R0603]  11.2 22.3 270 top
R8  30kΩ  [R0603]  19.2 33.6 0 top
R9  100kΩ  [R0603]  8 49.2 90 top
R10  1kΩ  [R0603]  10.22 90.61 270 top
R11  10kΩ  [R0603]  12.51 94.42 90 top
R12  10kΩ  [R0603]  12 45 90 top
R13  10kΩ  [R0603]  8.2 85.8 270 top
R14  300kΩ  [R0603]  16.1 17.5 270 top
R15  1kΩ  [R0603]  11.3 107.2 270 top
R16  100kΩ  [R0603]  18.1 17.5 90 top
R17  10kΩ  [R0603]  21.5 112 90 top
R18  10kΩ  [R0603]  9.97 59.6 90 top
R19  1kΩ  [R0603]  5.3 107.2 270 top
R20  10kΩ  [R0603]  7.6 114 90 top
R21  4.7kΩ  [R0603]  13.4 49.5 270 top
R22  10kΩ  [R0603]  15.9 56.7 90 bottom
R23  453kΩ  [R0603]  6.5 27 90 top
R24  1kΩ  [R0603]  8.3 107.2 270 top
R25  10kΩ  [R0603]  14 112 90 top
R26  100kΩ  [R0603]  7.9 22 180 top
R27  100kΩ  [R0603]  10.5 27 270 top
SW1  -  [按钮开关]  19 40 180 bottom
SW2  -  [按钮开关]  19 48 180 bottom
SW3  1TS001G-2700-1500-CT  [SW-SMD_4P-L5.1-W5.1-P3.70-LS6.5-TL-2]  20 56.6 90 top
U1  -  [PW4056]  12.3 7 90 bottom
U2  W25Q32JVSSIQ  [SOIC-8_L5.3-W5.3-P1.27-LS8.0-BL]  14.2 89 90 bottom
U3  -  [MY2480]  12 103.2 0 top
U4  STM32F401RCT6  [LQFP-64_L10.0-W10.0-P0.50-LS12.0-BL]  8.5 71 90 top
U5  -  [PW2051]  2.5 23 90 top
U6  -  [GC2400-TC010R]  18.5 114 180 bottom
U7  -  [OLED模块封装]  13 57.5 180 bottom
USB1  -  [typec]  19 27 90 top
Y1  32.768kHz  [OSC-SMD_L3.2-W1.5]  19.6 65 180 top
Y2  8MHz  [OSC-SMD_L5.0-W3.2]  19 72.5 270 top

## Footprints (pads in the part's own frame, mm; a bottom-side part is the same pattern mirrored in y, then rotated)
2P接线点
  oval 1x2 smd: 1(-1,0) 2(1,0)
C0603
  rect 0.8x0.899 smd: 1(-0.701,0) 2(0.701,0)
CONN-TH_2P-P1.25_1.25T-2AW
  round 1.001 hole 0.6: 1(-0.625,0) 2(0.625,0)
CONN-TH_2P-P2.50_HDGC2501WR-2P
  rect 1.524x1.524 hole 0.914: 1(-1.25,0)
  round 1.524 hole 0.914: 2(1.25,0)
CONN-TH_3P-P1.25_HDGC_HDGC1251WR-3P
  rect 1x1 hole 0.55: 1(-1.25,0)
  round 1 hole 0.55: 2(0,0) 3(1.25,0)
DO-214AC_L4.3-W2.7-LS5.3-RD
  rect 1.999x1.999 smd: 1(-2.299,0) 2(2.301,0)
GC2400-TC010R
  rect 1.2x3.5 smd: 1(-5,-9.5) 2(-3,-9.5) 3(-1,-9.5) 4(1,-9.5) 5(3,-9.5) 6(5,-9.5)
  rect 3.5x1.2 smd: 7(6.5,5.7) 8(-6.5,5.7)
HDR-TH_4P-P2.54-H-M-W9.4
  rect 1.8x1.8 hole 1.1: 1(-3.81,0)
  round 1.8 hole 1.1: 2(-1.27,0) 3(1.27,0) 4(3.81,0)
IND-SMD_L4.0-W4.0_0.47UH04209.5A
  rect 1.399x2.499 smd: 1(-1.9,0) 2(1.9,0)
LQFP-64_L10.0-W10.0-P0.50-LS12.0-BL
  oval 0.3x2 smd: 1(-3.75,-5.75) 2(-3.25,-5.75) 3(-2.75,-5.75) 4(-2.25,-5.75) 5(-1.75,-5.75) 6(-1.25,-5.75) 7(-0.75,-5.75) 8(-0.25,-5.75) 9(0.25,-5.75) 10(0.75,-5.75) 11(1.25,-5.75) 12(1.75,-5.75) 13(2.25,-5.75) 14(2.75,-5.75) 15(3.25,-5.75) 16(3.75,-5.75) 33(3.75,5.75) 34(3.25,5.75) 35(2.75,5.75) 36(2.25,5.75) 37(1.75,5.75) 38(1.25,5.75) 39(0.75,5.75) 40(0.25,5.75) 41(-0.25,5.75) 42(-0.75,5.75) 43(-1.25,5.75) 44(-1.75,5.75) 45(-2.25,5.75) 46(-2.75,5.75) 47(-3.25,5.75) 48(-3.75,5.75)
  oval 2x0.3 smd: 17(5.75,-3.75) 18(5.75,-3.25) 19(5.75,-2.75) 20(5.75,-2.25) 21(5.75,-1.75) 22(5.75,-1.25) 23(5.75,-0.75) 24(5.75,-0.25) 25(5.75,0.25) 26(5.75,0.75) 27(5.75,1.25) 28(5.75,1.75) 29(5.75,2.25) 30(5.75,2.75) 31(5.75,3.25) 32(5.75,3.75) 49(-5.75,3.75) 50(-5.75,3.25) 51(-5.75,2.75) 52(-5.75,2.25) 53(-5.75,1.75) 54(-5.75,1.25) 55(-5.75,0.75) 56(-5.75,0.25) 57(-5.75,-0.25) 58(-5.75,-0.75) 59(-5.75,-1.25) 60(-5.75,-1.75) 61(-5.75,-2.25) 62(-5.75,-2.75) 63(-5.75,-3.25) 64(-5.75,-3.75)
MY2480
  round 1.8 hole 1.1: 1(-10.16,-1.524) 2(-10.16,-4.064) 3(-10.16,-6.604) 4(-10.16,-9.144) 5(-10.16,-11.684) 6(-10.16,-14.224) 7(-10.16,-16.764) 8(-10.16,-19.304) 9(10.16,-19.304) 10(10.16,-16.764) 11(10.16,-14.224) 12(10.16,-11.684) 13(10.16,-9.144) 14(10.16,-6.604) 15(10.16,-4.064) 16(10.16,-1.524)
OLED模块封装
  rect 1.8x1.8 hole 1.1: 1(2.19,-1.5)
  round 1.8 hole 1.1: 2(4.73,-1.5) 3(7.27,-1.5) 4(9.81,-1.5)
OSC-SMD_L3.2-W1.5
  rect 1.05x1.7 smd: 1(-1.275,0) 2(1.275,0)
OSC-SMD_L5.0-W3.2
  rect 1.9x2.4 smd: 1(-2.05,0) 2(2.05,0)
PW2051
  rect 1.5x0.6 smd: 1(1.227,-0.95) 2(1.227,0) 3(1.227,0.95) 4(-1.227,0.95) 5(-1.227,-0.95)
PW4056
  oval 0.63x1.865 smd: 1(-1.905,-2.683) 2(-0.635,-2.683) 3(0.635,-2.683) 4(1.905,-2.683) 5(1.905,2.683) 6(0.635,2.683) 7(-0.635,2.683) 8(-1.905,2.683)
  rect 5.5x2.4 smd: 9(-0.889,0)
R0603
  rect 0.807x0.864 smd: 1(-0.754,0) 2(0.754,0)
SMA_L4.3-W2.6-LS5.2-RD
  rect 2x2 smd: 1(-2.2,0) 2(2.2,0)
SOIC-8_L5.3-W5.3-P1.27-LS8.0-BL
  oval 0.63x2.25 smd: 1(-1.905,-3.53) 2(-0.635,-3.53) 3(0.635,-3.53) 4(1.905,-3.53) 5(1.905,3.53) 6(0.635,3.53) 7(-0.635,3.53) 8(-1.905,3.53)
SOT-23-3_L2.9-W1.3-P1.90-LS2.4-BR
  rect 1.25x0.701 smd: 1(1.001,-0.95) 2(1.001,0.95) 3(-1.001,0)
SOT-23-3_L3.0-W1.7-P0.95-LS2.9-BR
  rect 1.038x0.532 smd: 1(1.101,-0.95) 2(1.101,0.95) 3(-1.101,0)
SOT-23_L2.9-W1.3-P1.90-LS2.4-BR
  rect 1x0.8 smd: 1(1.15,-0.95) 2(1.15,0.95) 3(-1.15,0)
SW-SMD_4P-L5.1-W5.1-P3.70-LS6.5-TL-2
  rect 1.7x1 smd: 1(-3.3,1.849) 2(3.3,1.851) 3(-3.3,-1.851) 4(3.3,-1.851)
typec
  round 0.9 hole 0.6: 1(-3,0) 2(-1.8,0) 3(-0.6,0) 4(0.6,0) 5(1.8,0) 6(3,0)
  oval 0.8x2.2 hole 0.6x2: 7(-4.3,0) 8(4.3,0)
XH2.54插件2P
  round 1.8 hole 1.05: 1(1.25,3.81) 2(-1.25,3.81)
按钮开关
  round 1.8 hole 1.2: 1(-3.25,2.25) 2(3.25,2.25) 3(-3.25,-2.25) 4(3.25,-2.25)

## Nets
As in the schematic.

Pads without a net: U1 1 7 8; U3 1 2 3 5 6; U4 2 8 9 14 33 39 40 41 44 45 51 52 53 54; U6 1 6; USB1 3 4 7 8

## Via types
v1: diameter 1.27, hole 0.711, Top Layer to Bottom Layer, 21 vias
v2: diameter 0.61, hole 0.305, Top Layer to Bottom Layer, 66 vias

## Routing (per net, layer and track width the routed paths; a pad name or vN(x,y) marks a point on that pad's centre or on a via; arc(x,y) is an arc through that point)
+3.3V: length 333.9
  Top Layer w0.3: U4.1 15.93,67.25 16.32,66.86 16.32,65.46 v1(14.92,64.06) ; U4.19 11.25,78.95 12,79.7 11.11,80.59 11.11,83.37 11.75,84 13.4,84 v1(14.41,82.99) 15,82.4 C5.2 C6.2 15,76.18 15.68,75.49 15.68,73.59 15.34,73.25 U4.13 ; 2.6,79.11 3.3,78.42 4,78.42 4.75,77.66 U4.32 ; U4.48 1.72,67.25 1.33,66.86 1.33,64.95 1.78,64.5 C8.2 ; 12.9,62.9 12.25,63.55 U4.64
  Top Layer w0.5: v1(11.37,48.19) 11.92,48.75 R21.2 ; L1.2 5.46,32 6.5,30.96 6.5,28.59 ; v1(14.54,85.91) 14.54,87.81 v1(12.89,89.46) ; R23.2 6.5,28.59 ; 6.5,28.59 7.17,29.27 8.06,29.27 8.44,28.88 8.44,27.76 C19.1 ; 3.87,34.87 3.7,34.7 ; 8,53.97 R9.2 9.19,49.95 v1(9.71,50.48) ; CN6.1 14.06,36.25 3.36,36.25 3.17,36.06
  Top Layer w0.8: CN5.1 1.71,5.96 1.71,5.01 2.47,4.25 18.86,4.25 19.75,5.14 CN4.1 ; C8.2 2.47,64.58 v1(2.47,65.84) ; v1(14.92,64.06) 13.76,62.9 12.9,62.9 ; 3.7,34.7 2.78,35.62 v1(1.2,35.62) ; 2.6,79.1 1.46,77.96 v1(1.46,77.15)
  Top Layer w1: U7.2 8.27,54.24 2.47,48.44 2.47,36.76 3.7,35.53 3.7,34.7 2.96,34.7 2.22,33.97 2.22,32.78 L1.2
  CPU1 w0.8: U7.2 8.27,58.18 14.16,64.06 v1(14.92,64.06) ; CN5.1 1.75,8.22 4.13,10.6 4.13,13.9 1.2,16.82 v1(1.2,35.62)
  CPU2 w0.8: v1(14.41,82.99) 14.41,64.57 v1(14.92,64.06) ; v1(2.47,65.84) 2.47,60.38 3.62,59.24 5.03,59.24 U7.2
  Bottom Layer w0.5: v1(14.92,64.06) 14.92,61.91 16.95,59.87 16.95,56.19 16.71,55.95 R22.1 ; v1(14.54,85.91) 14.79,86.16 17.21,86.16 17.72,85.65 17.72,84.83 17.65,84.77 ; v1(12.89,89.46) 12.76,89.59 10.63,89.59 ; v1(11.37,48.19) 11.37,49.33 10.22,50.48 v1(9.71,50.48) ; 17.69,87.05 15.94,87.05 15.68,87.31 15.68,87.81 16.19,88.32 17.69,88.32
  Bottom Layer w0.8: 13.79,117.02 15,115.81 15,97.59 ; 13.79,117.02 20.64,117.02 21.65,116.01 21.65,115.03 CN3.1 ; 13.79,117.02 11.75,117.02 ; v1(2.47,65.84) 2.47,76.13 v1(1.46,77.15) 3.87,79.56 3.87,96.32 7.05,99.5 13.09,99.5 15,97.59 ; CN7.1 5.65,117.02 11.75,117.02 ; CN9.1 12.63,115.01 12.63,116.13 11.75,117.02 ; 17.69,87.05 18.86,87.05 19.49,86.42 19.49,85.27 18.98,84.77 17.65,84.77 17.72,84.7 17.72,83.62 17.08,82.99 v1(14.41,82.99) ; 15,97.59 15,95
+3.7V: length 137.6
  Top Layer w0.5: R14.2 16.1,14.85 CN1.2 R4.2
  Top Layer w0.8: SW1.3 SW1.4
  Top Layer w1: Q1.3 11.97,18.5 13.25,17.22 CN1.2
  CPU1 w0.5: SW1.4 14.13,37.75 13.27,36.89 13.27,13.52 ; 13.27,12.02 CN1.2
  CPU1 w1: CN1.2 13.25,13.5 v1(19.87,20.12)
  CPU2 w1: U3.9 18.6,80.34 18.6,34.73 22.16,31.17 22.16,22.41 v1(19.87,20.12)
  Bottom Layer w0.8: U1.5 16.28,8.91 17.1,9.73 C4.2 14.65,10.6 CN1.2
GND: length 271.7
  Top Layer w0.254: 22.4,75.2 23.07,75.88 23.3,75.88
  Top Layer w0.3: U4.12 15.51,72.75 15.56,72.7 ; 10.09,58.86 10.81,58.15 U7.1 ; v2(6.67,87.69) 7.82,86.54 8.19,86.54 ; 15.81,62.29 16.59,62.29 C15.1 ; C16.1 23.18,61.93 23.18,61.02 23.05,60.89 ; U4.31 5.25,77.93 3.49,79.69 3.49,80.45 3.24,80.7 2.79,80.7 2.6,80.51 ; U4.18 11.75,77.91 12.89,79.05 12.89,80.83 12.62,81.1 C10.1 ; SW2.4 17.55,45.75 19,47.2 20.45,45.75 SW2.3 ; U4.47 1.46,67.75 0.82,67.11 0.82,63.43 1.14,63.11 2.39,63.11 2.4,63.1 ; C7.1 11.75,62.65 U4.63 ; C5.1 C6.1
  Top Layer w0.5: SW3.4 SW3.3 ; CN6.4 15.3,25.46 15.3,25.46 ; C11.1 7.5,81.92 7.94,82.35 8.19,82.35 ; Q4.2 11.8,45.95 R12.2 ; Q6.2 5.52,113.02 5.52,113.97 6.3,114.75 R20.2 ; C9.1 2.6,80.83 3.47,81.7 4.5,81.7 ; 22.92,67.49 22.4,68.02 22.4,69.1 ; R8.1 18.45,32.6 18.73,32.31 20.25,32.31 20.76,31.81 20.76,30.66 20.1,30 USB1.6 ; 19.41,7.85 20.25,8.69 20.25,12.12 18.6,13.77 v1(18.6,14.15) 18.1,14.66 R16.1 ; R25.2 13.92,112.83 11.77,112.83 Q7.2 ; R27.1 11.35,27.75 12.38,26.73 12.38,25.46 11.24,24.31 11.24,23.09 R7.1 9.98,23.05 8.92,22 R26.1 8.7,22.04 v1(8.7,23.68) ; C5.1 16.44,79.54 v1(16.44,81.59) ; R17.2 21.3,112.95 Q5.2 ; v1(12.76,82.73) 12.76,81.86 C10.1 ; 8.19,82.35 8.19,82.61 v1(9.08,83.5) ; 8.19,82.35 9.08,82.35 9.5,81.93 C12.1 ; 15.9,56.2 15.9,54.58 15.94,54.54
  Top Layer w0.7: R20.2 7.6,115.29 8.7,116.39 13.4,116.39 ; 13.4,116.39 14.16,115.63 14.16,112.91 R25.2 ; 13.4,116.39 22.03,116.39 22.92,115.5 22.92,114.18 R17.2 ; U5.2 2.5,25.86 v1(2.98,26.34) ; v1(4,16.06) 4,14.03
  Top Layer w0.8: Q2.2 20.59,7.85 21.02,7.42 21.02,6.02 CN4.2 ; 17.59,23.93 18.93,23.93 USB1.1 ; C7.1 12.91,61.5 14.41,60 ; CN5.2 3,8.95
  Top Layer w1: C22.1 6.19,34.7 6.79,34.09 ; 18.82,7.85 18.82,7.39 17.84,6.41 12.89,6.41 11.49,7.8 4.14,7.8 3,8.95 3,9.72 4.13,10.85 4.13,13.9 1.59,16.44 1.59,17.9 1.65,17.84 4.46,17.84 C2.1 ; 10.73,53.27 10.81,53.35 U7.1
  Top Layer w1.2: R11.2 12.44,95.24 10.23,95.24
  CPU1 w0.5: v1(12.76,82.73) 12,83.5 v1(9.08,83.5)
  CPU2 w0.3: v2(6.67,87.69) 6.67,85.91 v1(9.08,83.5)
  Bottom Layer w0.5: 18.5,10.6 18.6,10.7 v1(18.6,14.15) ; v1(8.7,23.68) 8.7,18.22 6.54,16.06 v1(4,16.06) ; CN4.2 21.02,5.98 21.02,3.87 20,2.85 R6.1 17.7,1.95 17.46,1.71 12.89,1.71 12.25,2.34 12.25,6.06 U1.9 ; v1(16.44,81.59) 13.91,81.59 v1(12.76,82.73) ; 16.25,84.77 15.3,84.77 15.05,84.51 ; 10.63,90.86 12.63,90.86
  Bottom Layer w0.7: v1(2.98,26.34) 2.98,17.07 v1(4,16.06)
  Bottom Layer w0.8: R5.1 3.62,4.25 3,4.87 CN5.2 3,6.78 ; 13.02,92.51 13.02,94.98 13,95 ; 3,6.78 3,9.6 3.49,10.09 5.71,10.09 C1.1 ; 3,6.78 3.85,7.63 U1.3 10.78,7.63 U1.9
  Bottom Layer w1: 3.11,110.17 5.47,110.17 5.5,110.2 ; 20.89,110.17 20.85,110.2 18.5,110.2
  vias: v2(1.08,109.28) v2(1.08,104.83) v2(1.08,15.04) v2(1.08,11.11) v2(2,1) v2(2.5,119) v2(4,1) v2(4.5,119) v2(11,119) v2(11,1) v2(13,119) v2(13,1) v2(15.3,24) v2(15.3,23) v2(19.5,119) v2(20,1) v2(21.5,119) v2(22,1) v2(22.92,15.17) v2(22.92,10.85) v2(23.05,109.15) v2(23.05,104.96)
VIN: length 14.4
  Top Layer w0.8: U5.4 1.55,19.34 1.59,19.3
  Top Layer w1: 6.2,17 6.2,14.37 6.03,14.2 ; 6.2,17 C2.2 6.2,18.68 5.27,19.61 1.91,19.61 1.6,19.3 ; 6.2,17 6.75,17.55 Q1.2
ADC_B: length 84.1
  Top Layer w0.3: v2(6.67,83.5) 6.67,79.81 6.73,79.75 7.56,79.75 7.25,79.44 U4.27 ; v2(14.92,18.47) 15.88,18.47 R14.1
  Top Layer w0.5: R14.1 16.1,19.4 16.57,19.87 17.72,19.87 18.1,19.49 18.1,18.26 R16.2
  CPU2 w0.3: v2(14.92,18.47) 13.2,20.19 13.2,60.96 4.38,69.78 4.38,81.21 v2(6.67,83.5)
ADC_P: length 98
  Top Layer w0.3: v2(10.6,84.77) 10.6,80.32 10.03,79.75 9.46,79.75 9.4,79.69 9.08,79.69 7.75,78.36 U4.26
  CPU2 w0.3: CN4.3 22.16,6.09 22.16,7.55 17.08,12.63 17.08,17.58 13.65,21.01 13.65,61.27 4.89,70.03 4.89,76.38 10.6,82.1 v2(10.6,84.77)
BAT_CHRG: length 48.7
  Top Layer w0.3: v2(20,35.11) 20,33.65 R8.2 ; v2(4.38,60.25) 6.41,60.25 8.75,62.59 U4.57
  Top Layer w0.5: R3.1 22.2,32.66 21.27,33.58 19.97,33.58 R8.2
  CPU1 w0.3: v2(20,35.11) 20,37.65 17.84,39.81 15.17,39.81 1.71,53.27 1.71,57.59 v2(4.38,60.25)
BAT_DONE: length 85.5
  Top Layer w0.3: v2(6.03,63.05) 5.52,63.05 5.25,63.32 U4.50
  CPU1 w0.3: v2(6.03,63.05) 5.4,62.41 4.25,62.41 0.81,58.97 0.81,52.27 6.28,46.79 6.28,23.68 5.01,22.41 5.01,12.63 v2(5.14,12.5) ; v2(15.68,3.23) 15.43,2.98 v2(7.56,2.98)
  CPU2 w0.3: v2(5.14,12.5) 5.14,5.39 v2(7.56,2.98)
  Bottom Layer w0.3: v2(15.68,3.23) 16.81,4.35 R6.2
  Bottom Layer w0.5: R6.2 R1.1 17.49,6.25 16.1,7.63 U1.6
FLASH_CS: length 21.4
  Top Layer w0.3: v2(10.86,74.22) 10.75,74.33 U4.20 ; v2(13.02,85.02) 12,86.04 v2(9.97,86.04)
  Bottom Layer w0.3: v2(9.97,86.04) 9.21,86.04 8.95,86.29 8.95,86.8 9.21,87.05 10.63,87.05 ; v2(13.02,85.02) 12.51,85.02 11.75,84.26 11.75,80.95 10.86,80.07 v2(10.86,74.22)
FLASH_MISO: length 22.8
  Top Layer w0.3: U4.22 9.75,74.89 9.21,74.35 v2(9.21,73.21) ; v2(8.95,89.08) 8.95,87.94 9.21,87.69 9.21,85.27 v2(9.71,84.77)
  Bottom Layer w0.3: v2(8.95,89.08) 8.95,88.7 9.33,88.32 10.63,88.32 ; v2(9.21,73.21) 9.21,81.99 10.22,83.01 10.22,84.13 9.71,84.64 v2(9.71,84.77)
FLASH_MOSI: length 27.4
  Top Layer w0.3: U4.23 9.25,75.03 8.44,74.22 v2(8.44,73.84)
  Bottom Layer w0.3: v2(8.44,73.84) 8.44,74.86 7.3,76 7.3,84.51 8.22,85.43 11.01,85.43 16.44,90.86 17.69,90.86
FLASH_SCK: length 21.9
  Top Layer w0.3: U4.21 10.25,74.38 v2(10.09,74.22)
  Bottom Layer w0.3: 17.69,89.59 16.32,89.59 11.24,84.51 11.24,81.34 10.25,80.35 10.25,74.38 v2(10.09,74.22)
I2C1_SCL: length 13.7
  Top Layer w0.3: v2(3.49,57.97) 4.51,58.98 6.16,58.98 9.25,62.08 U4.58
  Bottom Layer w0.3: U7.3 3.76,57.97 v2(3.49,57.97)
I2C1_SDA: length 12.6
  Top Layer w0.3: U4.59 9.75,61.81 6.28,58.35 5.14,58.35 3.24,56.44 3.24,56.05 U7.4
KEY2: length 27.1
  Top Layer w0.3: 15.75,50.25 13.91,52.09 13.91,58.48 11.25,61.13 U4.62 ; 15.75,50.25 R21.1 ; 15.75,50.25 SW2.2 17.35,50.25 C14.2 20.65,50.25 SW2.1
KEY_ON: length 26.3
  Top Layer w0.3: U4.61 10.75,60.74 12.63,58.86 12.63,51.11 9.84,48.32 8.13,48.32 R9.1
  Top Layer w0.5: R9.1 6.16,46.6 6.16,45.27 6.54,44.89 7.44,44.89 Q4.3
MOTOR: length 40.7
  Top Layer w0.3: v2(4.63,104.45) 5.3,105.12 R19.2 ; v2(6.16,72.19) 6.16,72.95 4.86,74.25 U4.34
  CPU1 w0.3: v2(6.16,72.19) 6.16,72.46 3.62,75 3.62,103.43 v2(4.63,104.45)
MRS_OUT: length 67
  Top Layer w0.3: v2(4.38,61.14) 6.41,61.14 8.25,62.98 U4.56
  CPU1 w0.3: v2(4.38,61.14) 4,61.14 1.26,58.4 1.26,52.58 6.92,46.92 6.92,23.3 6.28,22.66 6.28,8.03 CN5.3
MY_IO1: length 52.7
  Top Layer w0.3: U4.10 12.45,71.75 12.13,71.43 11.49,71.43 v2(11.24,71.68)
  CPU1 w0.3: U3.16 7.83,101.68 5.01,98.86 5.01,75.52 8.85,71.68 v2(11.24,71.68)
MY_IO2: length 48.8
  Top Layer w0.3: U4.11 11.94,72.25 v2(11.87,72.32)
  CPU1 w0.3: U3.15 8.08,99.14 5.52,96.58 5.52,75.65 8.85,72.32 v2(11.87,72.32)
MY_IO3: length 39.3
  Top Layer w0.3: v2(6.79,75.24) 7.94,75.24 8.25,75.55 U4.25
  CPU1 w0.3: U3.14 8.34,96.6 5.98,94.23 5.98,76.06 v2(6.79,75.24)
MY_IO4: length 36.2
  Top Layer w0.3: U4.24 8.75,75.29 8.06,74.61 v2(7.56,74.61)
  CPU1 w0.3: U3.13 22.01,93.91 8.7,93.91 7.56,92.77 v2(7.56,74.61)
MY_IO5: length 37.7
  Top Layer w0.3: v2(12.38,73.08) 12.38,73.81 12.82,74.25 U4.15
  CPU1 w0.3: U3.12 9.23,91.52 8.06,90.35 8.06,75.24 10.22,73.08 v2(12.38,73.08)
NRST: length 29.4
  Top Layer w0.254: SW3.2 17.92,60.13 v2(15.56,60.13)
  Top Layer w0.3: 18.15,59.9 18.15,53.3 ; U4.7 12.09,70.25 11.62,69.78 v2(11.62,68.76) ; SW3.2 15.9,57.65 C20.2
  Bottom Layer w0.3: R22.2 15.56,57.8 v2(15.56,60.13) 11.62,64.06 v2(11.62,68.76)
OSC32_IN: length 9.3
  Top Layer w0.3: U4.3 17.59,68.25 18.35,67.49 18.35,62.73 18.42,62.67
OSC32_OUT: length 11.7
  Top Layer w0.3: 20.95,62.67 20.85,62.77 20.85,65 20.89,65.04 20.89,66.98 19.12,68.75 U4.4
OSC_IN: length 8.7
  Top Layer w0.3: 22.41,70.48 22.4,70.49 19,70.49 17.76,69.25 U4.5
OSC_OUT: length 12.2
  Top Layer w0.3: U4.6 16.42,69.75 17.33,70.67 17.33,73.59 18.35,74.61 18.99,74.61 19.82,73.78 22.41,73.78
PWR_EN: length 28.1
  Top Layer w0.3: v2(4.51,44.38) 4.51,42.51 D3.2 ; v2(1.46,49.71) 1.46,59.49 4.13,62.16 6.67,62.16 7.75,63.24 U4.55
  Bottom Layer w0.3: v2(1.46,49.71) 4.51,46.67 v2(4.51,44.38)
REDL: length 44.9
  Top Layer w0.3: v2(7.3,71.68) 7.17,71.56 5.9,71.56 5.27,72.19 5.27,72.83 4.35,73.75 U4.35 ; R24.2 8.19,106.34 v2(8.19,104.45)
  CPU1 w0.3: v2(8.19,104.45) 6.16,104.45 4.07,102.36 4.07,75.18 7.3,71.95 v2(7.3,71.68)
RX1: length 19.4
  Top Layer w0.3: U4.43 0.98,69.75 0.95,69.78
  CPU1 w0.3: 0.95,69.78 1.97,69.78 2.22,70.03 2.22,71.18 1.84,71.56 0.95,71.56
  CPU2 w0.3: U3.8 2.47,83.26 2.47,72.45 1.59,71.56 0.95,71.56
  vias: v2(0.8,71.5) v2(0.8,69.7)
RX2: length 34.5
  Top Layer w0.3: v2(11.49,75.11) 11.87,75.11 12.25,75.49 U4.17
  Bottom Layer w0.3: 9,95 8.82,94.83 8.82,92.26 5.09,88.52 5.09,75.29 8.38,71.99 10.4,71.99 12.25,73.84 12.25,74.61 11.75,75.11 v2(11.49,75.11)
RX6: length 31.2
  Top Layer w0.3: U4.38 1.02,72.25 0.82,72.45
  CPU1 w0.3: 0.82,72.45 2.22,72.45 5.9,68.76 8.57,68.76 10.22,70.41 12,70.41 14.54,72.95 14.54,76.76 15.94,78.16 22.23,78.16 22.3,78.23
  vias: v2(0.8,72.4)
SOUNDCARD: length 17.2
  Top Layer w0.3: R10.2 10.09,89.72 7.05,89.72 5.4,88.07 5.4,79.44 6.25,78.58 U4.29
SW_EN: length 31
  Top Layer w0.5: R26.2 7.3,21.84 v1(7.3,20.63) ; v1(4.51,40.44) 4.51,38.12 7.73,38.12 8.02,38.41 ; v1(4.76,26.34) 3.45,25.03 U5.1
  Bottom Layer w0.5: v1(4.51,40.44) 4.76,40.19 v1(4.76,26.34) 4.76,23.17 v1(7.3,20.63)
SWCLK: length 43.5
  Top Layer w0.3: U4.49 4.75,63.67 v2(4.51,63.43)
  Bottom Layer w0.3: v2(4.51,63.43) 1.2,60.13 1.2,51.36 12.63,39.93 12.63,31.04 13.75,29.93 CN6.3
SWDIO: length 45.3
  Top Layer w0.3: v2(5.01,67.62) 4.38,68.25 U4.46
  Bottom Layer w0.3: v2(5.01,67.62) 5.27,67.37 5.27,63.18 1.71,59.62 1.71,51.62 13.4,39.93 13.4,33.58 14.51,32.47 CN6.2
TX1: length 20.2
  Top Layer w0.3: U4.42 1.5,70.25 1.08,70.67 0.95,70.67
  CPU2 w0.3: 0.95,70.67 2.35,70.67 3.36,71.68 3.36,84.91 U3.7
  vias: v2(0.8,70.6)
TX2: length 32.9
  Top Layer w0.3: v2(11.62,74.22) 12,74.22 12.53,74.75 U4.16
  Bottom Layer w0.3: v2(11.62,74.22) 11.62,73.97 10.09,72.45 8.57,72.45 5.54,75.48 5.54,88.08 11,93.54 11,95
TX6: length 32.6
  Top Layer w0.3: U4.37 1.41,72.75 0.82,73.34
  CPU1 w0.3: 22.3,80.73 17.49,80.73 14.03,77.27 14.03,73.08 11.87,70.92 10.09,70.92 8.38,69.22 6.09,69.22 1.97,73.34 0.82,73.34
  vias: v2(0.8,73.3)
USB+: length 65.4
  Top Layer w0.5: R2.2 21.85,25.2 USB1.2 ; R3.2 22.16,29.91 22.16,29.01 21.95,28.8 USB1.5
  Top Layer w0.8: v1(8.32,15.17) 8.32,12.16 D1.2
  Bottom Layer w0.5: 20.13,17.58 20.13,8.95 18.94,7.75 R1.2
  Bottom Layer w0.8: USB1.2 19.99,25.2 21.27,23.92 21.27,28 20.47,28.8 USB1.5 ; C1.2 8.3,8.91 U1.4 ; v1(8.32,15.17) 9.59,16.44 12,16.44
  Bottom Layer w1: 21.27,23.92 21.27,18.72 18.98,16.44 12,16.44 7.2,11.64 C1.2
UVL: length 48.1
  Top Layer w0.3: v2(8.06,70.92) 7.94,71.05 5.65,71.05 4.63,72.06 4.63,72.7 4.08,73.25 U4.36 ; v2(11.24,104.45) 11.24,106.38 R15.2
  CPU1 w0.3: v2(8.06,70.92) 8.06,71.83 4.52,75.37 4.52,100.53 7.43,103.43 10.22,103.43 v2(11.24,104.45)
$1N1304: length 3.9
  Top Layer w0.3: 4.76,80.25 4.76,79.43 5.75,78.44 U4.30
$1N1668: length 4.9
  Top Layer w0.3: U4.60 10.25,60.53 10.09,60.37
$1N1829: length 10.2
  Top Layer w0.3: U4.28 6.75,78.72 5.9,79.57 5.9,83.88 7.05,85.03 8.19,85.03
$1N9984: length 3.8
  Top Layer w0.5: CN9.2 9.35,112.97 Q7.3
$1N10713: length 7.8
  Top Layer w0.5: R25.1 13.8,111.05 Q7.1 10.09,111.05 8.3,109.26 R24.1
$1N11694: length 3.3
  Top Layer w0.5: Q6.3 2.38,112.78 CN7.2
$1N11697: length 7.2
  Top Layer w0.5: R20.1 7.56,113.2 7.56,111.56 7.04,111.05 Q6.1 5.45,108.1 R19.1
$1N15476: length 4.6
  Top Layer w0.8: U5.3 1.55,26.75 L1.1
$1N15617: length 16
  Top Layer w0.5: C19.2 8.44,26.24 8.44,25.33 7.94,24.82 ; R27.2 10.5,25.1 10.22,24.82 7.94,24.82 ; U5.5 4.21,21.01 5.27,21.01 5.65,21.39 5.65,25.4 R23.1 6.5,25.24 6.92,24.82 7.94,24.82
$1N23471: length 18.5
  Top Layer w0.5: Q4.1 11.8,44.05 R12.1 13.75,44.25 SW1.2 12.4,38.9 D2.2
  Top Layer w0.8: SW1.2 SW1.1
$1N28745: length 4.4
  Top Layer w0.5: R11.1 12.19,93.34 10.23,93.34 10.23,91.37 R10.1
$1N30076: length 6.2
  Top Layer w1: U3.4 7.69,94.06 7.93,94.29
$1N30362: length 20.6
  Top Layer w0.5: U3.11 20.36,88.98 18.5,90.84 CN2.1
$1N30425: length 24.1
  Top Layer w0.5: U3.10 22.14,86.42 20.25,86.42 16.5,90.17 CN2.2
$1N40650: length 2.9
  Bottom Layer w0.8: R5.2 7.61,6.37 U1.2
$1N44119: length 8.8
  Top Layer w1: CN1.1 10.75,10.7 11.3,10.15 18,10.15
$1N77249: length 6.4
  Top Layer w0.5: R4.1 19.49,11.16 19.49,9.45 19.11,9.07 17.59,9.07 17.05,8.53 17.05,7.85
$1N80171: length 16.8
  Top Layer w0.5: R2.1 21.9,22.28 21.14,21.52 11.21,21.52 11.2,21.53 11.2,20.72 10.73,20.25 9.97,20.25 9.17,19.45 Q1.1
$1N140145: length 11.6
  Top Layer w0.5: R15.1 11.35,108.01 13.91,108.01 16.83,110.93 19.23,110.93 Q5.1 21.3,111.05 R17.1
$1N144140: length 5.3
  Top Layer w0.5: CN3.2 18.87,115 17.08,113.21 17.08,112.03 Q5.3

## Copper pours and planes (outline as drawn; the poured copper is in the pictures)
GND on Top Layer: 0,120 24,120 24,0 0,0
GND on Bottom Layer: 0,120 24,120 24,0 0,0
